# Altium schematic sheet SHDN21-S02-V00-SegInterface.SchDoc
size A4
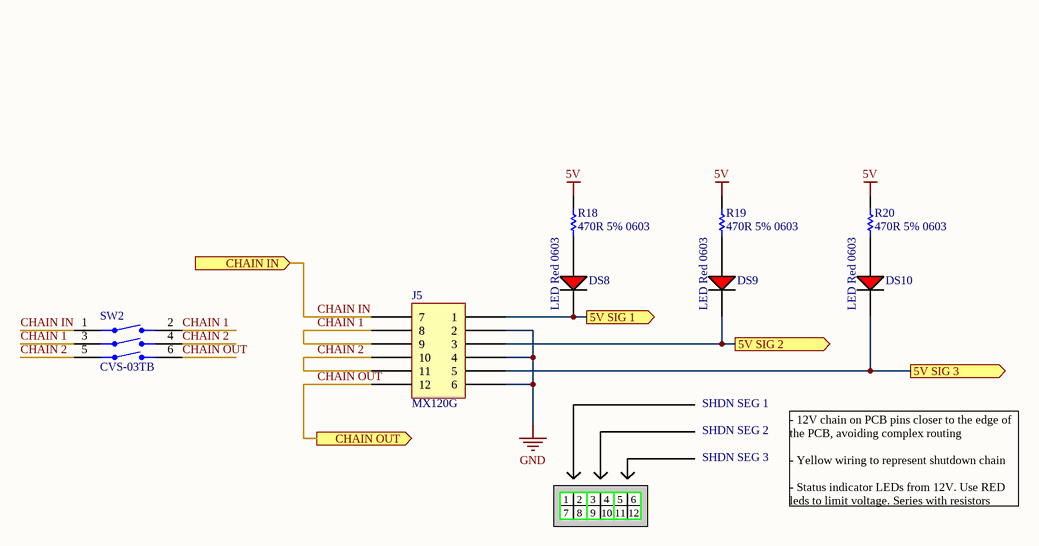
[diagram p0: SHDN21-S02-V00-SegInterface.SchDoc]

## Parts
DS8  LED Red 0603  [LED RED 0603]
DS9  LED Red 0603  [LED RED 0603]
DS10  LED Red 0603  [LED RED 0603]
J5  MX120G  [MX120G]
R18  470R 5% 0603  [Res_ThinFilm_0603]
R19  470R 5% 0603  [Res_ThinFilm_0603]
R20  470R 5% 0603  [Res_ThinFilm_0603]
SW2  CVS-03TB  [CVS-03TB]

## Ports
5V SIG 1 (out), 5V SIG 2 (out), 5V SIG 3 (out), CHAIN IN (in), CHAIN OUT (out)

## Nets
5V: R18.2 R19.2 R20.2
GND: J5.2 J5.4 J5.6
5V SIG 1: DS8.2(C) J5.1 ; port 5V SIG 1
5V SIG 2: DS9.2(C) J5.3 ; port 5V SIG 2
5V SIG 3: DS10.2(C) J5.5 ; port 5V SIG 3
CHAIN 1: J5.8 J5.9 SW2.2 SW2.3
CHAIN 2: J5.10 J5.11 SW2.4 SW2.5
CHAIN IN: J5.7 SW2.1 ; port CHAIN IN
CHAIN OUT: J5.12 SW2.6 ; port CHAIN OUT
NetDS8_1: DS8.1(A) R18.1
NetDS9_1: DS9.1(A) R19.1
NetDS10_1: DS10.1(A) R20.1

## Notes on the sheet
- SHDN SEG 1
- SHDN SEG 2
- SHDN SEG 3
- 1
- 7
- 2
- 8
- 3
- 9
- 4
- 10
- 5
- 11
- 6
- 12
- - 12V chain on PCB pins closer to the edge of the PCB, avoiding complex routing
  - Yellow wiring to represent shutdown chain
  - Status indicator LEDs from 12V. Use RED leds to limit voltage. Series with resistors

## Library data of the parts
J5 = MX120G: MX120G with standard connector layout
R18-R20 = 470R 5% 0603: Resistor, SMD, 470R, 0.1W, 5%, 0603
SW2 = CVS-03TB: SWITCH SLIDE DIP SPST 100MA 6V